# Altium project UZ_D_Temperature_Card_LTC2983.PrjPCB
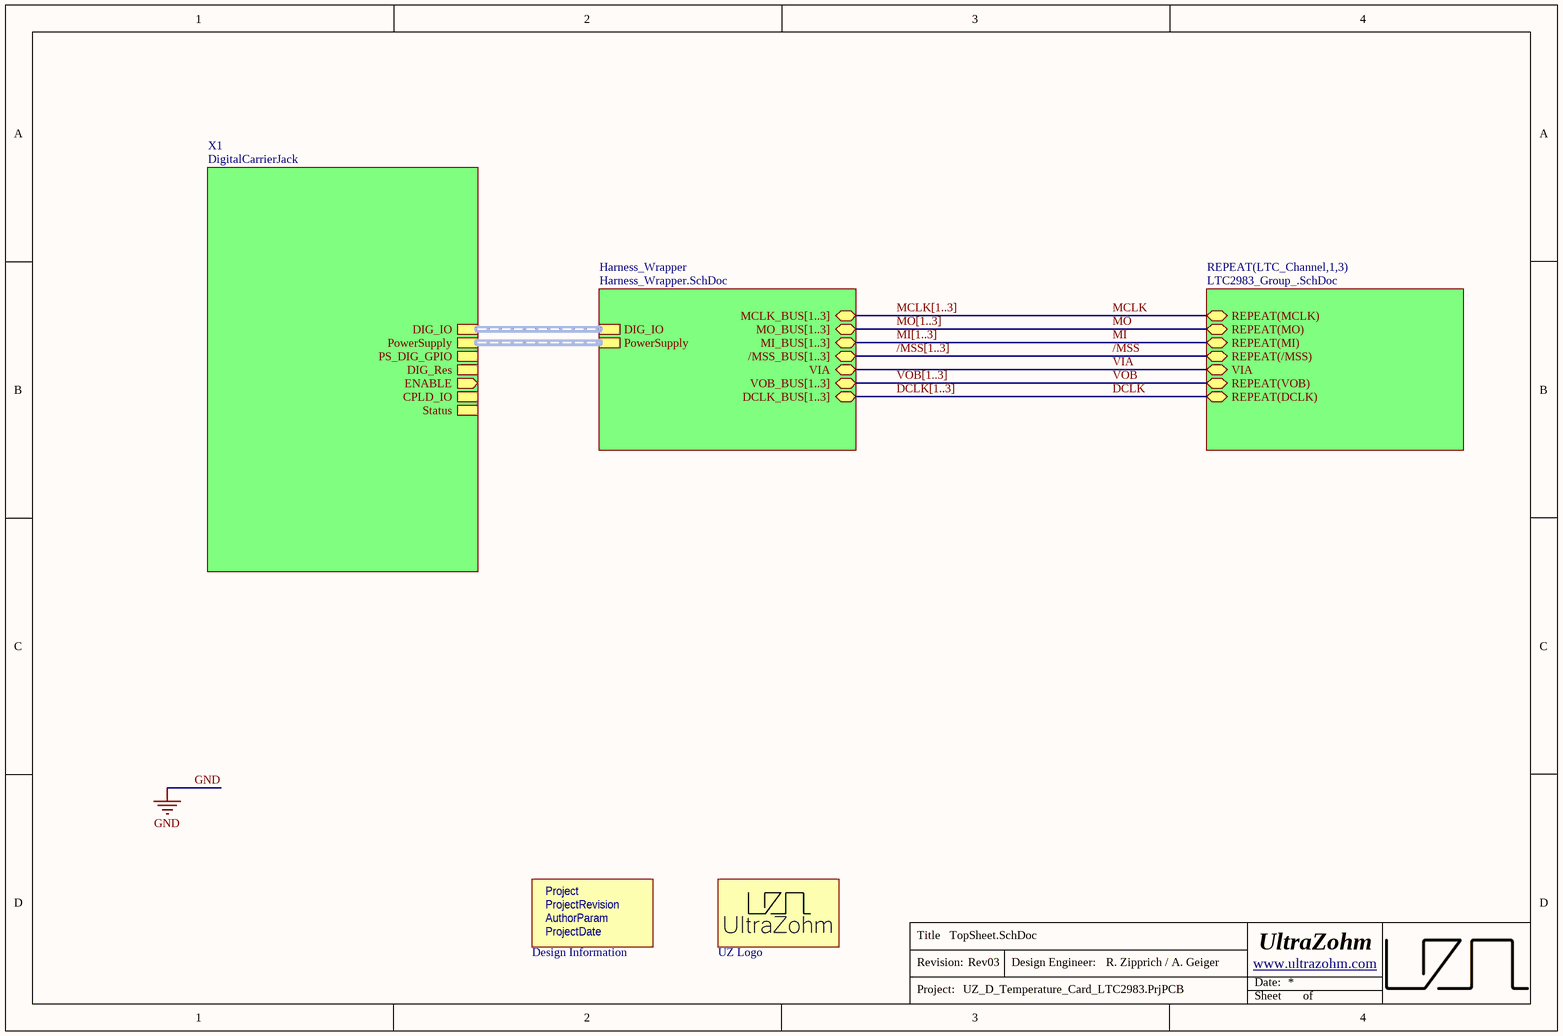
[diagram p0: TopSheet.SchDoc]
Author: R. Zipprich / A. Geiger; AuthorParam: R. Zipprich / A. Geiger; Project: UZ_D_Temperature_LTC2983; ProjectDate: 12/2023; ProjectRevision: Rev03
4 sheets, 296 parts. Net scope: hierarchical (ports join the sheet entries above them; power ports are global).
Board file: UZ_D_Temperature_Card_LTC2983.PcbDoc
Sheets:
  TopSheet.SchDoc
    X1 = DigitalCarrierJack.SchDoc
    LTC_Channel1 = LTC2983_Group_.SchDoc
    LTC_Channel2 = LTC2983_Group_.SchDoc
    LTC_Channel3 = LTC2983_Group_.SchDoc
    Harness_Wrapper = Harness_Wrapper.SchDoc

## Sheet TopSheet.SchDoc
size A4; Author: R. Zipprich / A. Geiger; CompanyName: Technische Hochschule Nürnberg Georg Simon Ohm; Organization: UltraZohm; Address1: Kesslerplatz 12; Address2: 90489 Nürnberg; Address3: GERMANY; Website: www.ultrazohm.com

### Parts
INFO  Design Information  [Design_info]  (no BOM)
LOGO  UZ Logo  [UZ_Logo_small]  (no BOM)

### Sub-sheets
Harness_Wrapper = Harness_Wrapper.SchDoc: DIG_IO (harness DigCon_DIG_IO), PowerSupply (harness DigCon_PowerSupply), VIA (bidir), MCLK_BUS[1..3] (bidir), MO_BUS[1..3] (bidir), MI_BUS[1..3] (bidir), /MSS_BUS[1..3] (bidir), VOB_BUS[1..3] (bidir), DCLK_BUS[1..3] (bidir)
REPEAT(LTC_Channel,1,3) = LTC2983_Group_.SchDoc: REPEAT(MCLK) (bidir), REPEAT(MO) (bidir), REPEAT(MI) (bidir), REPEAT(/MSS) (bidir), VIA (bidir), REPEAT(VOB) (bidir), REPEAT(DCLK) (bidir)
X1 = DigitalCarrierJack: DIG_IO (harness DigCon_DIG_IO), PowerSupply (harness DigCon_PowerSupply), PS_DIG_GPIO (harness DigCon_PS_DIG_GPIO), DIG_Res (harness DigCon_DIG_Res), ENABLE (out), CPLD_IO (harness DigCon_DCPLD_IO), Status (harness DigCon_Status)

### Nets
/MSS: sheet REPEAT(LTC_Channel,1,3)/REPEAT(/MSS)
DCLK: sheet REPEAT(LTC_Channel,1,3)/REPEAT(DCLK)
MCLK: sheet REPEAT(LTC_Channel,1,3)/REPEAT(MCLK)
MI: sheet REPEAT(LTC_Channel,1,3)/REPEAT(MI)
MO: sheet REPEAT(LTC_Channel,1,3)/REPEAT(MO)
VIA: sheet REPEAT(LTC_Channel,1,3)/VIA, sheet Harness_Wrapper/VIA
VOB: sheet REPEAT(LTC_Channel,1,3)/REPEAT(VOB)

### Buses and harness runs
bus /MSS[1..3] = sheet Harness_Wrapper//MSS_BUS[1..3]
bus DCLK[1..3] = sheet Harness_Wrapper/DCLK_BUS[1..3]
bus MCLK[1..3] = sheet Harness_Wrapper/MCLK_BUS[1..3]
bus MI[1..3] = sheet Harness_Wrapper/MI_BUS[1..3]
bus MO[1..3] = sheet Harness_Wrapper/MO_BUS[1..3]
bus VOB[1..3] = sheet Harness_Wrapper/VOB_BUS[1..3]
harness sheet Harness_Wrapper/DIG_IO = sheet X1/DIG_IO
harness sheet Harness_Wrapper/PowerSupply = sheet X1/PowerSupply

### Notes on the sheet
- Title
- Revision:
- Design Engineer:
- Date:
- Project:
- Sheet
- of
- (in symbol Design Information) Project; ProjectRevision; AuthorParam; ProjectDate

### Library data of the parts
INFO = Design Information: Manufacturer: UltraZohm; Created from: MGremer; Manufacturer Part Number: Design Information; PartID: 12; Created On: 03.11.2021 09:04:23; ComponentLink1Description: https://docs.ultrazohm.com/; ComponentLink1URL: homepage; Component Type: Design Information; Last Updated: 03.11.2021 09:28:34; Supplier 1: -; Supplier Part Number 1: -; Type: Design Information; Value: Design Information; Live Cycle Status: 1
LOGO = Logo small: Manufacturer: UltraZohm; Created from: MGremer; Created: Jan2021_Liegmann; Value: Logo; Manufacturer Part Number: Logo small; PartID: 10; Created On: 03.11.2021 09:04:23; ComponentLink1Description: https://docs.ultrazohm.com/; ComponentLink1URL: homepage; Component Type: Logo; Last Updated: 03.11.2021 09:05:50; Supplier 1: -; Supplier Part Number 1: -; Type: Logo; Live Cycle Status: 1

## Sheet DigitalCarrierJack.SchDoc
size A4; Author: R. Zipprich / A. Geiger; CompanyName: Technische Hochschule Nürnberg Georg Simon Ohm; Organization: UltraZohm; Address1: Kesslerplatz 12; Address2: 90489 Nürnberg; Address3: GERMANY; Website: www.ultrazohm.com
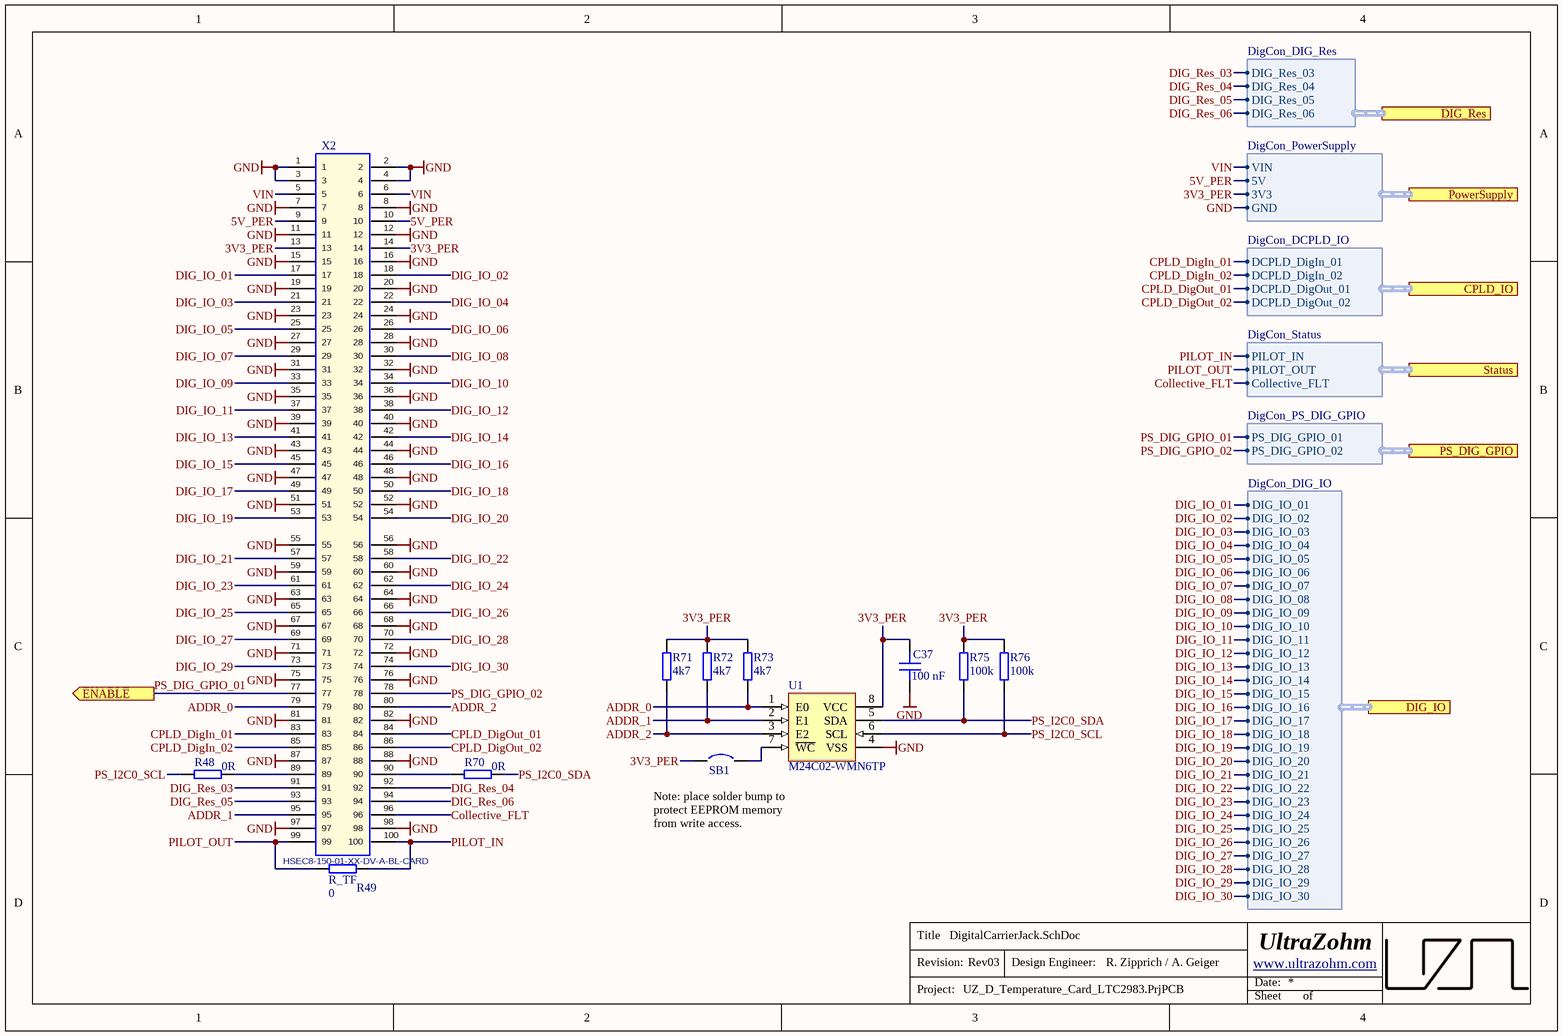
[diagram p1: DigitalCarrierJack.SchDoc]

### Parts
C37  100 nF  [C_0603]
R48  0R  [RES 0603_1608]
R49  R_TF  value 0  [RESC1608X55X30NL15T15]
R70  0R  [RES 0603_1608]
R71  4k7  [RES 0603_1608]
R72  4k7  [RES 0603_1608]
R73  4k7  [RES 0603_1608]
R75  100k  [RES 0603_1608]
R76  100k  [RES 0603_1608]
SB1  Solder Bump 0603  [SB_0603]  (value not drawn)  (no BOM)
U1  M24C02-WMN6TP  [D0008A_N]
X2  HSEC8-150-01-XX-DV-A-BL-CARD  [HSEC8-150-01-XX-DV-A-BL-CARD]  (no BOM)

### Ports
CPLD_IO (harness DigCon_DCPLD_IO), DIG_IO (harness DigCon_DIG_IO), DIG_Res (harness DigCon_DIG_Res), ENABLE (out), PowerSupply (harness DigCon_PowerSupply), PS_DIG_GPIO (harness DigCon_PS_DIG_GPIO), Status (harness DigCon_Status)

### Harnesses
DigCon_PowerSupply: GND, 3V3, 5V, VIN
DigCon_Status: PILOT_IN, PILOT_OUT, Collective_FLT
DigCon_DCPLD_IO: DCPLD_DigIn_01, DCPLD_DigIn_02, DCPLD_DigOut_01, DCPLD_DigOut_02
DigCon_PS_DIG_GPIO: PS_DIG_GPIO_01, PS_DIG_GPIO_02
DigCon_DIG_IO: DIG_IO_01, DIG_IO_02, DIG_IO_03, DIG_IO_04, DIG_IO_05, DIG_IO_06, DIG_IO_07, DIG_IO_08, DIG_IO_09, DIG_IO_10, DIG_IO_11, DIG_IO_12, DIG_IO_13, DIG_IO_14, DIG_IO_15, DIG_IO_16, DIG_IO_17, DIG_IO_18, DIG_IO_19, DIG_IO_20, DIG_IO_21, DIG_IO_22, DIG_IO_23, DIG_IO_24, DIG_IO_25, DIG_IO_26, DIG_IO_27, DIG_IO_28, DIG_IO_29, DIG_IO_30
DigCon_DIG_Res: DIG_Res_03, DIG_Res_04, DIG_Res_05, DIG_Res_06

### Nets
GND: C37.2 U1.4(VSS) X2.1 X2.2 X2.3 X2.4 X2.7 X2.8 X2.11 X2.12 X2.15 X2.16 X2.19 X2.20 X2.23 X2.24 X2.27 X2.28 X2.31 X2.32 X2.35 X2.36 X2.39 X2.40 X2.43 X2.44 X2.47 X2.48 X2.51 X2.52 X2.55 X2.56 X2.59 X2.60 X2.63 X2.64 X2.67 X2.68 X2.71 X2.72 X2.75 X2.76 X2.81 X2.82 X2.87 X2.88 X2.97 X2.98 ; port PowerSupply.GND
VIN: X2.5 X2.6 ; port PowerSupply.VIN
3V3_PER: C37.1 R71.2 R72.2 R73.2 R75.2 R76.2 SB1.1 U1.8(VCC) X2.13 X2.14 ; port PowerSupply.3V3
5V_PER: X2.9 X2.10 ; port PowerSupply.5V
ADDR_0: R73.1 U1.1(E0) X2.79
ADDR_1: R72.1 U1.2(E1) X2.95
ADDR_2: R71.1 U1.3(E2) X2.80
Collective_FLT: X2.96 ; port Status.Collective_FLT
CPLD_DigIn_01: X2.83 ; port CPLD_IO.DCPLD_DigIn_01
CPLD_DigIn_02: X2.85 ; port CPLD_IO.DCPLD_DigIn_02
CPLD_DigOut_01: X2.84 ; port CPLD_IO.DCPLD_DigOut_01
CPLD_DigOut_02: X2.86 ; port CPLD_IO.DCPLD_DigOut_02
DIG_IO_01: X2.17 ; port DIG_IO.DIG_IO_01
DIG_IO_02: X2.18 ; port DIG_IO.DIG_IO_02
DIG_IO_03: X2.21 ; port DIG_IO.DIG_IO_03
DIG_IO_04: X2.22 ; port DIG_IO.DIG_IO_04
DIG_IO_05: X2.25 ; port DIG_IO.DIG_IO_05
DIG_IO_06: X2.26 ; port DIG_IO.DIG_IO_06
DIG_IO_07: X2.29 ; port DIG_IO.DIG_IO_07
DIG_IO_08: X2.30 ; port DIG_IO.DIG_IO_08
DIG_IO_09: X2.33 ; port DIG_IO.DIG_IO_09
DIG_IO_10: X2.34 ; port DIG_IO.DIG_IO_10
DIG_IO_11: X2.37 ; port DIG_IO.DIG_IO_11
DIG_IO_12: X2.38 ; port DIG_IO.DIG_IO_12
DIG_IO_13: X2.41 ; port DIG_IO.DIG_IO_13
DIG_IO_14: X2.42 ; port DIG_IO.DIG_IO_14
DIG_IO_15: X2.45 ; port DIG_IO.DIG_IO_15
DIG_IO_16: X2.46 ; port DIG_IO.DIG_IO_16
DIG_IO_17: X2.49 ; port DIG_IO.DIG_IO_17
DIG_IO_18: X2.50 ; port DIG_IO.DIG_IO_18
DIG_IO_19: X2.53 ; port DIG_IO.DIG_IO_19
DIG_IO_20: X2.54 ; port DIG_IO.DIG_IO_20
DIG_IO_21: X2.57 ; port DIG_IO.DIG_IO_21
DIG_IO_22: X2.58 ; port DIG_IO.DIG_IO_22
DIG_IO_23: X2.61 ; port DIG_IO.DIG_IO_23
DIG_IO_24: X2.62 ; port DIG_IO.DIG_IO_24
DIG_IO_25: X2.65 ; port DIG_IO.DIG_IO_25
DIG_IO_26: X2.66 ; port DIG_IO.DIG_IO_26
DIG_IO_27: X2.69 ; port DIG_IO.DIG_IO_27
DIG_IO_28: X2.70 ; port DIG_IO.DIG_IO_28
DIG_IO_29: X2.73 ; port DIG_IO.DIG_IO_29
DIG_IO_30: X2.74 ; port DIG_IO.DIG_IO_30
DIG_Res_03: X2.91 ; port DIG_Res.DIG_Res_03
DIG_Res_04: X2.92 ; port DIG_Res.DIG_Res_04
DIG_Res_05: X2.93 ; port DIG_Res.DIG_Res_05
DIG_Res_06: X2.94 ; port DIG_Res.DIG_Res_06
PILOT_IN: R49.2 X2.100 ; port Status.PILOT_IN
PILOT_OUT: R49.1 X2.99 ; port Status.PILOT_OUT
PS_DIG_GPIO_01: X2.77 ; port ENABLE, port PS_DIG_GPIO.PS_DIG_GPIO_01
PS_DIG_GPIO_02: X2.78 ; port PS_DIG_GPIO.PS_DIG_GPIO_02
PS_I2C0_SCL: R48.1 R76.1 U1.6(SCL)
PS_I2C0_SDA: R70.2 R75.1 U1.5(SDA)
NetR48_2: R48.2 X2.89
NetR70_1: R70.1 X2.90
NetSB1_2: SB1.2 U1.7(~{WC})

### Notes on the sheet
- Note: place solder bump to protect EEPROM memory from write access.
- Title
- Revision:
- Design Engineer:
- Date:
- Project:
- Sheet
- of

### Library data of the parts
C37 = C0603C104K9PACTU: Capacitor 0603, 6.3 VDC, 100 nF, X5R; Manufacturer: KEMET; Tolerance: 10 %; Voltage Rating: 6.3 VDC; Created from: MGremer; Manufacturer Part Number: C0603C104K9PACTU; PartID: 70; Created On: 20.12.2020 13:54:13; ComponentLink1Description: Datasheet; ComponentLink1URL: https://www.mouser.de/datasheet/2/212/KEM_C1006_X5R_SMD-1103249.pdf; Component Type: Capacitor 0603; Device Package: 0603; Last Updated: 25.01.2024 18:56:23; Mounting Type: SMD; Operating Temperature: -55 - 85°C; Series: SMD Comm X5R; Supplier 1: Mouser; Supplier Part Number 1: 80-C0603C104K9P; Type: Capacitor; Value: 100 nF; Live Cycle Status: 1; Stock number: not stored; LCSC Part Number: C14663
R48 R70 = RC0603JR-070RL: SMD resistor E24 series; Manufacturer: YAGEO; Tolerance: 5%; Created from: MGremer; Manufacturer Part Number: RC0603JR-070RL; PartID: 1; Created On: 14.12.2020 16:17:14; ComponentLink1Description: Datasheet; ComponentLink1URL: https://www.mouser.de/datasheet/2/447/PYu-RC_Group_51_RoHS_L_10-1664068.pdf; Component Type: SMD resistor; Device Package: 0603; Last Updated: 04.03.2021 09:09:42; Mounting Type: SMD; Supplier 1: Mouser; Supplier Part Number 1: 603-RC0603JR-070RL; Supplier 2: LCSC; Supplier Part Number 2: C21189; Type: Resistor; Value: 0R; Live Cycle Status: 1; Stock number: Labor SMD Container; LCSC Part Number: C21189
R49 = R_0.1W_SMD: Standard thick film resistor; MPN: ERJU030R00V; Parameter1: V; Parameter1Desc: Package Method; Parameter2: F; Parameter2Desc: Tolerance Symbol; MaxVoltage: 100; MF: Panasonic; Created: 2019-12-08_Thilo_Wendt; Supplier 1: Mouser; Package: RESC1608X55X30NL15T15; HelpURL: https://www.mouser.de/datasheet/2/315/AOA0000C334-1314047.pdf; Parameter3: *; Parameter3Desc: *; ComponentLink1Description: Datasheet; ComponentLink1URL: https://www.mouser.de/datasheet/2/315/AOA0000C334-1314047.pdf; Supplier Part Number 1: 667-ERJ-U030R00V; LCSC Part Number: C21189
R71-R73 = 0603WAF4701T5E: SMD resistor E24 series; Manufacturer: UNI-ROYAL; Tolerance: 1%; Created from: AGeiger; Manufacturer Part Number: 0603WAF4701T5E; PartID: 90; Created On: 14.12.2020 16:17:14; ComponentLink1Description: Datasheet; ComponentLink1URL: https://datasheet.lcsc.com/lcsc/2206010116_UNI-ROYAL-Uniroyal-Elec-0603WAF4701T5E_C23162.pdf; Component Type: SMD resistor; Device Package: 0603; Last Updated: 25.08.2022 20:03:04; Mounting Type: SMD; Supplier 1: LCSC; Supplier Part Number 1: C23162; Type: Resistor; Value: 4k7; Live Cycle Status: 1; Stock number: Labor SMD Container; LCSC Part Number: C23162
R75 R76 = RK73B1JTTD104J: SMD resistor E24 series; Manufacturer: KOA Speer; Tolerance: 5%; Created from: MGremer; Manufacturer Part Number: RK73B1JTTD104J; PartID: 122; Created On: 14.12.2020 16:17:14; ComponentLink1Description: Datasheet; ComponentLink1URL: https://www.mouser.de/datasheet/2/219/RK73B-1825463.pdf; Component Type: SMD resistor; Device Package: 0603; Last Updated: 27.05.2022 14:04:10; Mounting Type: SMD; Supplier 1: Mouser; Supplier Part Number 1: 660-RK73B1JTTD104J; Type: Resistor; Value: 100k; Live Cycle Status: 1; Stock number: Labor SMD Container; LCSC Part Number: C25803
SB1 = =Value: Created from: AGeiger; Revision: July-2002: Re-released for DXP Platform.; PartID: 1; Created On: 09.01.2024 17:13:56; Component Type: Solder Bump; Device Package: 0603; Last Updated: 09.01.2024 17:13:56; Manufacturer Part Number: Solder Bump 0603; Mounting Type: SMD; Value: Solder Bump 0603
U1 = M24C02-WMN6TP: 2Kbit I2C SOP-8 EEPROM ROHS; Manufacturer: STMicroelectronics; Created from: AGeiger; Manufacturer Part Number: M24C02-WMN6TP; PartID: 1; Created On: 19.11.2023 14:54:27; ComponentLink1Description: Datasheet; ComponentLink1URL: https://www.st.com/resource/en/datasheet/m24c01-w.pdf; Component Type: EEPROM; Device Package: SOIC-8; Last Updated: 19.11.2023 21:39:04; Mounting Type: SMD; Operating Temperature: -40 to +85 °C; Series: M24xxx; Supplier 1: Mouser; Supplier Part Number 1: 511-M24C02-WMN6TP; Supplier 2: LCSC; Supplier Part Number 2: C7562; Type: Memory; Value: M24C02-WMN6TP; LCSC Part Number: C7562
X2 = HSEC8-150-01-XX-DV-A-BL-CARD: Mating Card Layout for HSEC8-150-01-XX-DV-A-BL; Manufacturer: SAMTEC; Created: 2018_04_23_AGeiger; Value: HSEC8-150-01-XX-DV-A-BL-CARD

## Sheet LTC2983_Group_.SchDoc
size A4; Author: R. Zipprich / A. Geiger; CompanyName: Technische Hochschule Nürnberg Georg Simon Ohm; Organization: UltraZohm; Address1: Kesslerplatz 12; Address2: 90489 Nürnberg; Address3: GERMANY; Website: www.ultrazohm.com
Used 3 times, as channels LTC_Channel1, LTC_Channel2, LTC_Channel3. Parts and nets are listed once, with the designators drawn on the sheet.
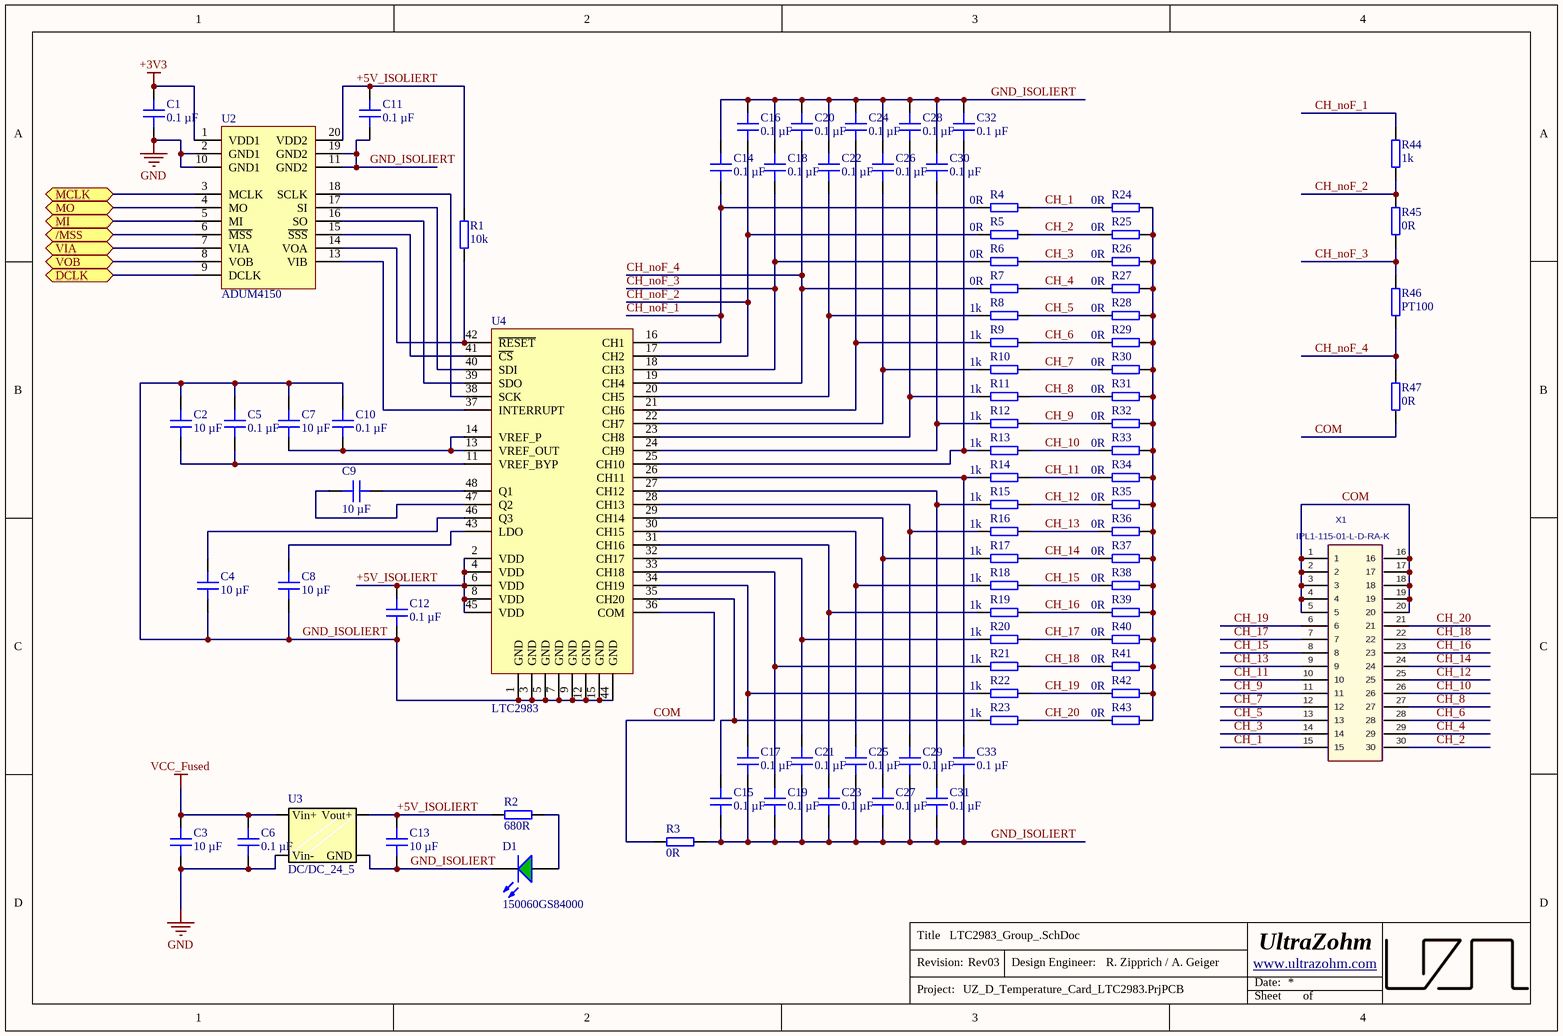
[diagram p2: LTC2983_Group_.SchDoc]

### Parts
C1  0.1 µF  [C_0603]
C2  10 µF  [C_0603]
C3  10 µF  [C_0603]
C4  10 µF  [C_0603]
C5  0.1 µF  [C_0603]
C6  0.1 µF  [C_0603]
C7  10 µF  [C_0603]
C8  10 µF  [C_0603]
C9  10 µF  [C_0603]
C10  0.1 µF  [C_0603]
C11  0.1 µF  [C_0603]
C12  0.1 µF  [C_0603]
C13  10 µF  [C_0603]
C14  0.1 µF  [C_0603]
C15  0.1 µF  [C_0603]
C16  0.1 µF  [C_0603]
C17  0.1 µF  [C_0603]
C18  0.1 µF  [C_0603]
C19  0.1 µF  [C_0603]
C20  0.1 µF  [C_0603]
C21  0.1 µF  [C_0603]
C22  0.1 µF  [C_0603]
C23  0.1 µF  [C_0603]
C24  0.1 µF  [C_0603]
C25  0.1 µF  [C_0603]
C26  0.1 µF  [C_0603]
C27  0.1 µF  [C_0603]
C28  0.1 µF  [C_0603]
C29  0.1 µF  [C_0603]
C30  0.1 µF  [C_0603]
C31  0.1 µF  [C_0603]
C32  0.1 µF  [C_0603]
C33  0.1 µF  [C_0603]
D1  150060GS84000  [WL-SMCW_0603]
R1  10k  [RES 0603_1608]
R2  680R  [RES 0603_1608]
R3  0R  [RES 0603_1608]
R4  0R  [RES 0603_1608]
R5  0R  [RES 0603_1608]
R6  0R  [RES 0603_1608]
R7  0R  [RES 0603_1608]
R8  1k  [RES 0603_1608]
R9  1k  [RES 0603_1608]
R10  1k  [RES 0603_1608]
R11  1k  [RES 0603_1608]
R12  1k  [RES 0603_1608]
R13  1k  [RES 0603_1608]
R14  1k  [RES 0603_1608]
R15  1k  [RES 0603_1608]
R16  1k  [RES 0603_1608]
R17  1k  [RES 0603_1608]
R18  1k  [RES 0603_1608]
R19  1k  [RES 0603_1608]
R20  1k  [RES 0603_1608]
R21  1k  [RES 0603_1608]
R22  1k  [RES 0603_1608]
R23  1k  [RES 0603_1608]
R24  0R  [RES 0603_1608]
R25  0R  [RES 0603_1608]
R26  0R  [RES 0603_1608]
R27  0R  [RES 0603_1608]
R28  0R  [RES 0603_1608]
R29  0R  [RES 0603_1608]
R30  0R  [RES 0603_1608]
R31  0R  [RES 0603_1608]
R32  0R  [RES 0603_1608]
R33  0R  [RES 0603_1608]
R34  0R  [RES 0603_1608]
R35  0R  [RES 0603_1608]
R36  0R  [RES 0603_1608]
R37  0R  [RES 0603_1608]
R38  0R  [RES 0603_1608]
R39  0R  [RES 0603_1608]
R40  0R  [RES 0603_1608]
R41  0R  [RES 0603_1608]
R42  0R  [RES 0603_1608]
R43  0R  [RES 0603_1608]
R44  1k  [RES 0603_1608]
R45  0R  [RES 0603_1608]
R46  PT100  [RES 0603_1608]
R47  0R  [RES 0603_1608]
U2  ADUM4150  [SOIC-20-ADUM4150]
U3  DC/DC_24_5  [SIP4DCDC]
U4  LTC2983  [48_LGFP(7x7)]
X1  IPL1-115-01-L-D-RA-K  [IPL1-115-01-XX-D-RA]

### Ports
/MSS (bidir), DCLK (bidir), MCLK (bidir), MI (bidir), MO (bidir), VIA (bidir), VOB (bidir)

### Nets
+3V3: C1.2 U2.1(VDD1)
GND: C1.1 C3.1 C6.1 U2.2(GND1) U2.10(GND1) U3.2(Vin-)
VCC_Fused: C3.2 C6.2 U3.1(Vin+)
+5V_ISOLIERT: C11.2 C12.2 C13.2 R1.2 R2.1 U2.20(VDD2) U3.6(Vout+) U4.2(VDD) U4.4(VDD) U4.6(VDD) U4.8(VDD) U4.45(VDD)
/MSS: U2.6(~{MSS}) ; port /MSS
CH_1: R4.2 R24.1 X1.15
CH_2: R5.2 R25.1 X1.30
CH_3: R6.2 R26.1 X1.14
CH_4: R7.2 R27.1 X1.29
CH_5: R8.2 R28.1 X1.13
CH_6: R9.2 R29.1 X1.28
CH_7: R10.2 R30.1 X1.12
CH_8: R11.2 R31.1 X1.27
CH_9: R12.2 R32.1 X1.11
CH_10: R13.2 R33.1 X1.26
CH_11: R14.2 R34.1 X1.10
CH_12: R15.2 R35.1 X1.25
CH_13: R16.2 R36.1 X1.9
CH_14: R17.2 R37.1 X1.24
CH_15: R18.2 R38.1 X1.8
CH_16: R19.2 R39.1 X1.23
CH_17: R20.2 R40.1 X1.7
CH_18: R21.2 R41.1 X1.22
CH_19: R22.2 R42.1 X1.6
CH_20: R23.2 R43.1 X1.21
CH_noF_1: C14.1 R4.1 R44.2 U4.16(CH1)
CH_noF_2: C16.1 R5.1 R44.1 R45.2 U4.17(CH2)
CH_noF_3: C18.1 R6.1 R45.1 R46.2 U4.18(CH3)
CH_noF_4: C20.1 R7.1 R46.1 R47.2 U4.19(CH4)
COM: R3.1 R47.1 U4.36(COM) X1.1 X1.2 X1.3 X1.4 X1.5 X1.16 X1.17 X1.18 X1.19 X1.20
DCLK: U2.9(DCLK) ; port DCLK
GND_ISOLIERT: C2.2 C4.1 C5.2 C7.2 C8.1 C10.2 C11.1 C12.1 C13.1 C14.2 C15.1 C16.2 C17.1 C18.2 C19.1 C20.2 C21.1 C22.2 C23.1 C24.2 C25.1 C26.2 C27.1 C28.2 C29.1 C30.2 C31.1 C32.2 C33.1 D1.1(K) R3.2 U2.11(GND2) U2.19(GND2) U3.4(GND) U4.1(GND) U4.3(GND) U4.5(GND) U4.7(GND) U4.9(GND) U4.12(GND) U4.15(GND) U4.44(GND)
MCLK: U2.3(MCLK) ; port MCLK
MI: U2.5(MI) ; port MI
MO: U2.4(MO) ; port MO
VIA: U2.7(VIA) ; port VIA
VOB: U2.8(VOB) ; port VOB
NetC2_1: C2.1 C5.1 U4.11(VREF_BYP)
NetC4_2: C4.2 U4.46(Q3)
NetC7_1: C7.1 C10.1 U4.13(VREF_OUT) U4.14(VREF_P)
NetC8_2: C8.2 U4.43(LDO)
NetC9_1: C9.1 U4.48(Q1)
NetC9_2: C9.2 U4.47(Q2)
NetC15_2: C15.2 R23.1 U4.35(CH20)
NetC17_2: C17.2 R22.1 U4.34(CH19)
NetC19_2: C19.2 R21.1 U4.33(CH18)
NetC21_2: C21.2 R20.1 U4.32(CH17)
NetC22_1: C22.1 R8.1 U4.20(CH5)
NetC23_2: C23.2 R19.1 U4.31(CH16)
NetC24_1: C24.1 R9.1 U4.21(CH6)
NetC25_2: C25.2 R18.1 U4.30(CH15)
NetC26_1: C26.1 R10.1 U4.22(CH7)
NetC27_2: C27.2 R17.1 U4.29(CH14)
NetC28_1: C28.1 R11.1 U4.23(CH8)
NetC29_2: C29.2 R16.1 U4.28(CH13)
NetC30_1: C30.1 R12.1 U4.24(CH9)
NetC31_2: C31.2 R15.1 U4.27(CH12)
NetC32_1: C32.1 R13.1 U4.25(CH10)
NetC33_2: C33.2 R14.1 U4.26(CH11)
NetD1_2: D1.2(A) R2.2
NetR1_1: R1.1 U2.14(VOA) U4.42(~{RESET})
NetR24_2: R24.2 R25.2 R26.2 R27.2 R28.2 R29.2 R30.2 R31.2 R32.2 R33.2 R34.2 R35.2 R36.2 R37.2 R38.2 R39.2 R40.2 R41.2 R42.2 R43.2
NetU2_13: U2.13(VIB) U4.37(INTERRUPT)
NetU2_15: U2.15(~{SSS}) U4.41(~{CS})
NetU2_16: U2.16(SO) U4.39(SDO)
NetU2_17: U2.17(SI) U4.40(SDI)
NetU2_18: U2.18(SCLK) U4.38(SCK)

### Channels
LTC_Channel1: designators C1=C1A C2=C2A C3=C3A C4=C4A C5=C5A C6=C6A C7=C7A C8=C8A C9=C9A C10=C10A C11=C11A C12=C12A C13=C13A C14=C14A C15=C15A C16=C16A C17=C17A C18=C18A C19=C19A C20=C20A C21=C21A C22=C22A C23=C23A C24=C24A C25=C25A C26=C26A C27=C27A C28=C28A C29=C29A C30=C30A C31=C31A C32=C32A C33=C33A D1=D1A R1=R1A R2=R2A R3=R3A R4=R4A R5=R5A R6=R6A R7=R7A R8=R8A R9=R9A R10=R10A R11=R11A R12=R12A R13=R13A R14=R14A R15=R15A R16=R16A R17=R17A R18=R18A R19=R19A R20=R20A R21=R21A R22=R22A R23=R23A R24=R24A R25=R25A R26=R26A R27=R27A R28=R28A R29=R29A R30=R30A R31=R31A R32=R32A R33=R33A R34=R34A R35=R35A R36=R36A R37=R37A R38=R38A R39=R39A R40=R40A R41=R41A R42=R42A R43=R43A R44=R44A R45=R45A R46=R46A R47=R47A U2=IC1A U3=IC2A U4=IC3A X1=X1A; ports /MSS=/MSS1 DCLK=DCLK1 MCLK=MCLK1 MI=MI1 MO=MO1 VIA=VIA VOB=VOB1
LTC_Channel2: designators C1=C1B C2=C2B C3=C3B C4=C4B C5=C5B C6=C6B C7=C7B C8=C8B C9=C9B C10=C10B C11=C11B C12=C12B C13=C13B C14=C14B C15=C15B C16=C16B C17=C17B C18=C18B C19=C19B C20=C20B C21=C21B C22=C22B C23=C23B C24=C24B C25=C25B C26=C26B C27=C27B C28=C28B C29=C29B C30=C30B C31=C31B C32=C32B C33=C33B D1=D1B R1=R1B R2=R2B R3=R3B R4=R4B R5=R5B R6=R6B R7=R7B R8=R8B R9=R9B R10=R10B R11=R11B R12=R12B R13=R13B R14=R14B R15=R15B R16=R16B R17=R17B R18=R18B R19=R19B R20=R20B R21=R21B R22=R22B R23=R23B R24=R24B R25=R25B R26=R26B R27=R27B R28=R28B R29=R29B R30=R30B R31=R31B R32=R32B R33=R33B R34=R34B R35=R35B R36=R36B R37=R37B R38=R38B R39=R39B R40=R40B R41=R41B R42=R42B R43=R43B R44=R44B R45=R45B R46=R46B R47=R47B U2=IC1B U3=IC2B U4=IC3B X1=X1B; ports /MSS=/MSS2 DCLK=DCLK2 MCLK=MCLK2 MI=MI2 MO=MO2 VIA=VIA VOB=VOB2
LTC_Channel3: designators C1=C1C C2=C2C C3=C3C C4=C4C C5=C5C C6=C6C C7=C7C C8=C8C C9=C9C C10=C10C C11=C11C C12=C12C C13=C13C C14=C14C C15=C15C C16=C16C C17=C17C C18=C18C C19=C19C C20=C20C C21=C21C C22=C22C C23=C23C C24=C24C C25=C25C C26=C26C C27=C27C C28=C28C C29=C29C C30=C30C C31=C31C C32=C32C C33=C33C D1=D1C R1=R1C R2=R2C R3=R3C R4=R4C R5=R5C R6=R6C R7=R7C R8=R8C R9=R9C R10=R10C R11=R11C R12=R12C R13=R13C R14=R14C R15=R15C R16=R16C R17=R17C R18=R18C R19=R19C R20=R20C R21=R21C R22=R22C R23=R23C R24=R24C R25=R25C R26=R26C R27=R27C R28=R28C R29=R29C R30=R30C R31=R31C R32=R32C R33=R33C R34=R34C R35=R35C R36=R36C R37=R37C R38=R38C R39=R39C R40=R40C R41=R41C R42=R42C R43=R43C R44=R44C R45=R45C R46=R46C R47=R47C U2=IC1C U3=IC2C U4=IC3C X1=X1C; ports /MSS=/MSS3 DCLK=DCLK3 MCLK=MCLK3 MI=MI3 MO=MO3 VIA=VIA VOB=VOB3

### Notes on the sheet
- Title
- Revision:
- Design Engineer:
- Date:
- Project:
- Sheet
- of

### Library data of the parts
C1 C5 C6 C10-C12 C14-C33 = C0603X104K5RAC7411: Capacitor 0603, 50 VDC, 0.1 µF, X7R; Manufacturer: KEMET; Tolerance: 10 %; Voltage Rating: 50 VDC; Created from: MGremer; Manufacturer Part Number: C0603X104K5RAC7411; PartID: 3; Created On: 20.12.2020 13:54:13; ComponentLink1Description: Datasheet; ComponentLink1URL: https://www.mouser.de/datasheet/2/212/1/KEM_C1013_X7R_FT_CAP_SMD-1103280.pdf; Component Type: Capacitor 0603; Device Package: 0603; Last Updated: 04.03.2021 09:24:28; Mounting Type: SMD; Operating Temperature: -55 - 125°C; Series: SMD Comm X7R Flex; Supplier 1: Mouser; Supplier Part Number 1: 80-C0603X104K5R7411; Type: Capacitor; Value: 0.1 µF; Live Cycle Status: 1; Stock number: Labor SMD Container; Supplier 2: LCSC; Supplier Part Number 2: C14663; LCSC Part Number: C14663
C2-C4 C7-C9 C13 = GRM185R60J106ME15D: Capacitor 0603, 6.3 VDC, 10 µF, X5R; Manufacturer: muRata; Tolerance: 20 %; Voltage Rating: 6.3 VDC; Created from: MGremer; Manufacturer Part Number: GRM185R60J106ME15D; PartID: 10; Created On: 20.12.2020 13:54:13; ComponentLink1Description: Datasheet; ComponentLink1URL: https://www.mouser.de/datasheet/2/281/murata_03052018_GRM_Series_1-1310166.pdf; Component Type: Capacitor 0603; Device Package: 0603; Last Updated: 27.05.2022 14:13:40; Mounting Type: SMD; Operating Temperature: -55 - 85°C; Series: GRM; Supplier 1: Mouser; Supplier Part Number 1: 81-GRM185R60J106ME5D; Type: Capacitor; Value: 10 µF; Live Cycle Status: 1; Stock number: Labor SMD Container; LCSC Part Number: C19702
D1 = 150060GS84000: WL-SMCW SMD Mono-color Chip LED Waterclear Green; Manufacturer: Wuerth Elektronik; Type: Standard; Created from: MGremer; Forward Current I_f: 20 mA; Forward Voltage U_f: 3.2 V; Wavelength: 525 nm; Light Intensity: 3000 mcd; Nominal Power: 78 mW; Manufacturer Part Number: 150060GS84000; PartID: 2; Created On: 08.12.2020 10:41:11; ComponentLink1Description: Datasheet; ComponentLink1URL: https://www.mouser.de/datasheet/2/445/150060GS75020-1714345.pdf; Component Type: LED Diode; Device Package: 0603; Last Updated: 25.01.2024 19:29:32; Mounting Type: SMD; Operating Temperature: -40 - 85 °C; Supplier 1: Mouser; Supplier Part Number 1: 710-150060GS84000; Supplier 2: Farnell; Supplier Part Number 2: 3408612; Supplier 3: Digi-Key; Supplier Part Number 3: 732-150060GS84000CT-ND; Live Cycle Status: 1; Stock number: not stored; Color: green; LCSC Part Number: C72043
R1 = RK73B1JTTD103J: SMD resistor E24 series; Manufacturer: KOA Speer; Tolerance: 5%; Created from: MGremer; Manufacturer Part Number: RK73B1JTTD103J; PartID: 98; Created On: 14.12.2020 16:17:14; ComponentLink1Description: Datasheet; ComponentLink1URL: https://www.mouser.de/datasheet/2/219/RK73B-1825463.pdf; Component Type: SMD resistor; Device Package: 0603; Last Updated: 27.05.2022 14:04:22; Mounting Type: SMD; Supplier 1: Mouser; Supplier Part Number 1: 660-RK73B1JTTD103J; Type: Resistor; Value: 10k; Live Cycle Status: 1; Stock number: Labor SMD Container; LCSC Part Number: C25804
R2 = RK73B1JTTDD681J: SMD resistor E24 series; Manufacturer: KOA Speer; Tolerance: 5%; Created from: MGremer; Manufacturer Part Number: RK73B1JTTDD681J; PartID: 70; Created On: 14.12.2020 16:17:14; ComponentLink1Description: Datasheet; ComponentLink1URL: https://www.mouser.de/datasheet/2/219/RK73B-1825463.pdf; Component Type: SMD resistor; Device Package: 0603; Last Updated: 27.05.2022 08:00:04; Mounting Type: SMD; Supplier 1: Mouser; Supplier Part Number 1: 660-RK73B1JTTDD681J; Type: Resistor; Value: 680R; Live Cycle Status: 1; Stock number: Labor SMD Container; Supplier 2: LCSC; Supplier Part Number 2: C23228; LCSC Part Number: C23228
R3-R7 R24-R43 R45 R47 = RC0603JR-070RL: as R48 on sheet DigitalCarrierJack; Manufacturer Part Number: RC0603JR-070RL; PartID: 1; Created On: 14.12.2020 16:17:14; ComponentLink1Description: Datasheet; ComponentLink1URL: https://www.mouser.de/datasheet/2/447/PYu-RC_Group_51_RoHS_L_10-1664068.pdf; Component Type: SMD resistor; Device Package: 0603; Last Updated: 04.03.2021 09:09:42; Mounting Type: SMD; Supplier 1: Mouser; Supplier Part Number 1: 603-RC0603JR-070RL; Supplier 2: LCSC; Supplier Part Number 2: C21189; Type: Resistor; Value: 0R; Live Cycle Status: 1; Stock number: Labor SMD Container; LCSC Part Number: C21189
R8-R23 = 0603WAF1001T5E: SMD resistor E24 series; Manufacturer: UNI-ROYAL; Tolerance: 1%; Created from: AGeiger; Manufacturer Part Number: 0603WAF1001T5E; PartID: 74; Created On: 14.12.2020 16:17:14; ComponentLink1Description: Datasheet; ComponentLink1URL: https://datasheet.lcsc.com/lcsc/2206010130_UNI-ROYAL-Uniroyal-Elec-0603WAF1001T5E_C21190.pdf; Component Type: SMD resistor; Device Package: 0603; Last Updated: 25.08.2022 16:01:46; Mounting Type: SMD; Supplier 1: LCSC; Supplier Part Number 1: C21190; Type: Resistor; Value: 1k; Live Cycle Status: 1; Stock number: Labor SMD Container; LCSC Part Number: C21190
R44 = PCF-W0603LF-03-1001-B-P-LT: SMD resistor 0.1%; Manufacturer: IRC / TT Electronics; Created from: MGremer; Manufacturer Part Number: PCF-W0603LF-03-1001-B-P-LT; PartID: 163; Created On: 14.12.2020 16:17:14; ComponentLink1Description: Datasheet; ComponentLink1URL: https://www.mouser.de/datasheet/2/414/PCF-1528243.pdf; Component Type: SMD resistor; Device Package: 0603; Last Updated: 02.03.2021 14:07:32; Mounting Type: SMD; Supplier 1: Mouser; Supplier Part Number 1: 66-PCFW0603LF031001B; Type: Resistor; Tolerance: 0.1%; Value: 1k; Live Cycle Status: 1; Stock number: not stored
R46 = PCF-W0603LF-03-1001-B-P-LT: SMD resistor 0.1%; Manufacturer: IRC / TT Electronics; Value: 1k; Created from: MGremer; Manufacturer Part Number: PCF-W0603LF-03-1001-B-P-LT; PartID: 163; Created On: 14.12.2020 16:17:14; ComponentLink1Description: Datasheet; ComponentLink1URL: https://www.mouser.de/datasheet/2/414/PCF-1528243.pdf; Component Type: SMD resistor; Device Package: 0603; Last Updated: 02.03.2021 14:07:32; Mounting Type: SMD; Supplier 1: Mouser; Supplier Part Number 1: 66-PCFW0603LF031001B; Type: Resistor; Tolerance: 0.1%; Live Cycle Status: 1; Stock number: not stored
U3 = DC/DC_Single: pin to pad: 1>2 2>1 4>3 6>4; LCSC Part Number: C970824
X1 = IPL1-115-01-L-D-RA-K: Terminal Assembly, Double Row, Right Angle, Thru-Hole, 2.54 mm x 2.54 mm Pitch, 30 Pins; Manufacturer: SAMTEC; Created from: TWendt; Number of positions: 30; Manufacturer Part Number: IPL1-115-01-L-D-RA-K; PartID: 34; Created On: 12.02.2021 15:31:18; ComponentLink1Description: Homepage; ComponentLink1URL: https://www.samtec.com/products/ipl1; Component Type: Samtec Connector; Device Package: Connector; Last Updated: 15.02.2021 10:07:42; Supplier 1: SAMTEC; Supplier Part Number 1: IPL1-115-01-L-D-RA-K; Type: Connector; Live Cycle Status: 1; Number of rows: 2; Stock number: not stored; LCSC Part Number: C7423882
U2 = ADUM4150: LCSC Part Number: C660948
U4 = LTC2983: LCSC Part Number: C427448

## Sheet Harness_Wrapper.SchDoc
size A4; Author: R. Zipprich / A. Geiger; CompanyName: Technische Hochschule Nürnberg Georg Simon Ohm; Organization: UltraZohm; Address1: Kesslerplatz 12; Address2: 90489 Nürnberg; Address3: GERMANY; Website: www.ultrazohm.com
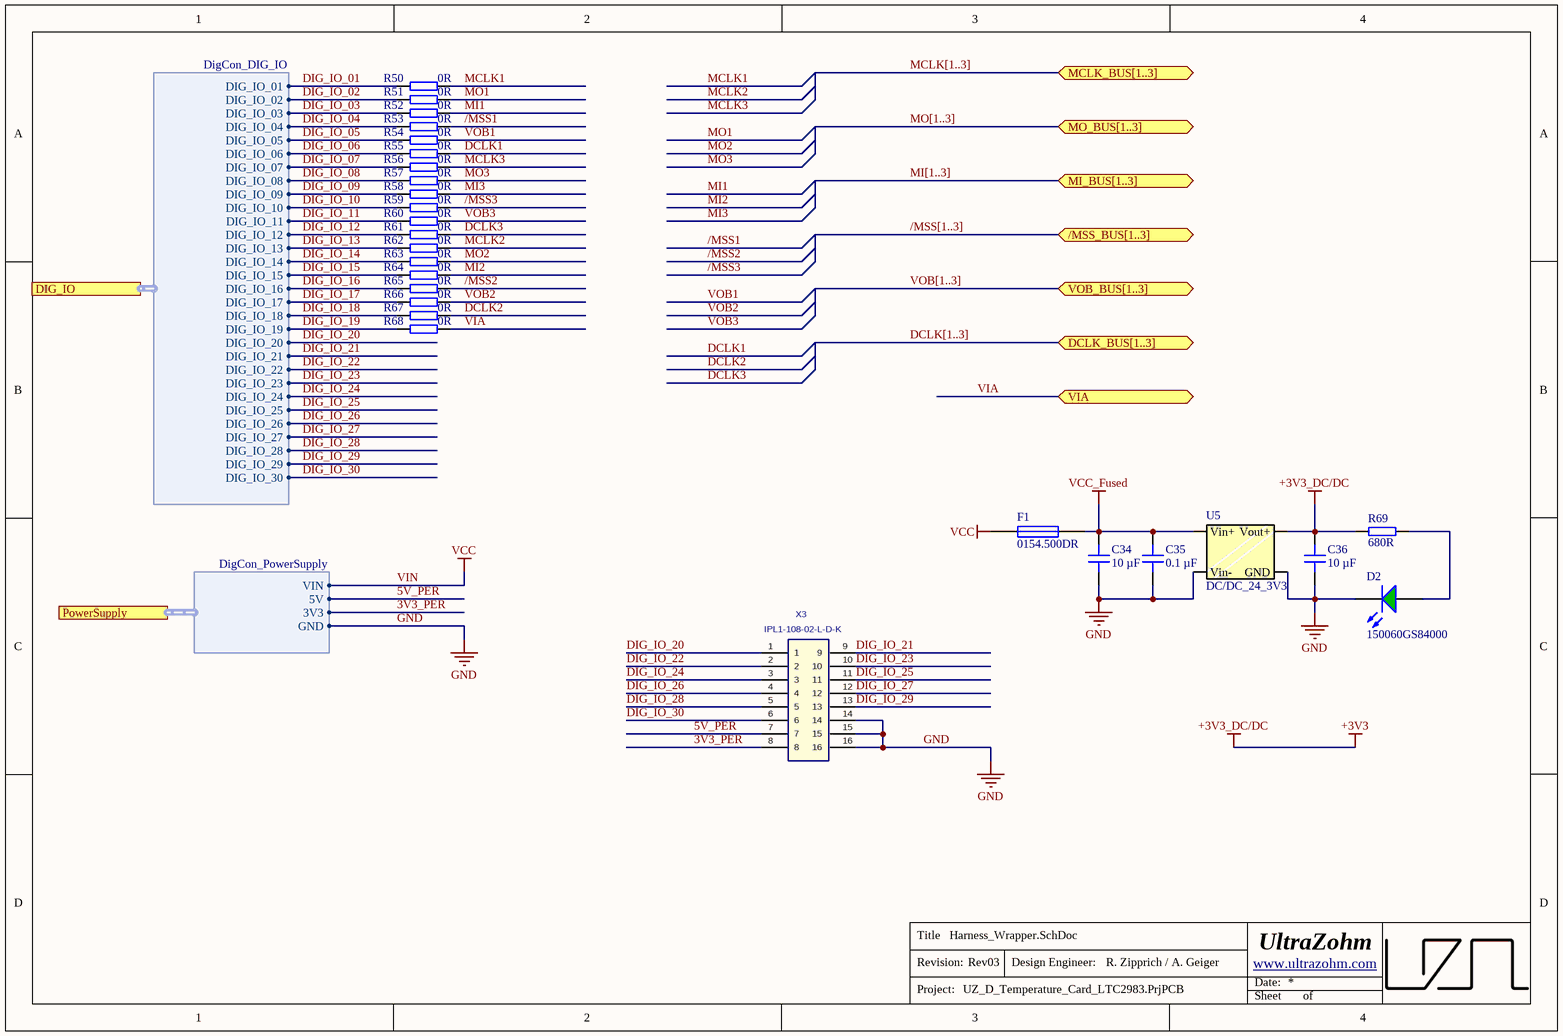
[diagram p3: Harness_Wrapper.SchDoc]

### Parts
C34  10 µF  [C_0603]
C35  0.1 µF  [C_0603]
C36  10 µF  [C_0603]
D2  150060GS84000  [WL-SMCW_0603]
F1  0154.500DR  [Littlefuse_154]
R50  0R  [RES 0603_1608]
R51  0R  [RES 0603_1608]
R52  0R  [RES 0603_1608]
R53  0R  [RES 0603_1608]
R54  0R  [RES 0603_1608]
R55  0R  [RES 0603_1608]
R56  0R  [RES 0603_1608]
R57  0R  [RES 0603_1608]
R58  0R  [RES 0603_1608]
R59  0R  [RES 0603_1608]
R60  0R  [RES 0603_1608]
R61  0R  [RES 0603_1608]
R62  0R  [RES 0603_1608]
R63  0R  [RES 0603_1608]
R64  0R  [RES 0603_1608]
R65  0R  [RES 0603_1608]
R66  0R  [RES 0603_1608]
R67  0R  [RES 0603_1608]
R68  0R  [RES 0603_1608]
R69  680R  [RES 0603_1608]
U5  DC/DC_24_3V3  [SIP4DCDC]
X3  IPL1-108-02-L-D-K  [IPL1-108-02-L-D-K]

### Ports
/MSS_BUS[1..3] (bidir), DCLK_BUS[1..3] (bidir), DIG_IO (harness DigCon_DIG_IO), MCLK_BUS[1..3] (bidir), MI_BUS[1..3] (bidir), MO_BUS[1..3] (bidir), PowerSupply (harness DigCon_PowerSupply), VIA (bidir), VOB_BUS[1..3] (bidir)

### Harnesses
DigCon_DIG_IO: DIG_IO_01, DIG_IO_02, DIG_IO_03, DIG_IO_04, DIG_IO_05, DIG_IO_06, DIG_IO_07, DIG_IO_08, DIG_IO_09, DIG_IO_10, DIG_IO_11, DIG_IO_12, DIG_IO_13, DIG_IO_14, DIG_IO_15, DIG_IO_16, DIG_IO_17, DIG_IO_18, DIG_IO_19, DIG_IO_20, DIG_IO_21, DIG_IO_22, DIG_IO_23, DIG_IO_24, DIG_IO_25, DIG_IO_26, DIG_IO_27, DIG_IO_28, DIG_IO_29, DIG_IO_30
DigCon_PowerSupply: GND, 3V3, 5V, VIN

### Nets
+3V3: C36.2 R69.1 U5.6(Vout+)  [also labelled +3V3_DC/DC]
GND: C34.1 C35.1 C36.1 D2.1(K) U5.2(Vin-) U5.4(GND) X3.14 X3.15 X3.16 ; port PowerSupply.GND
VCC_Fused: C34.2 C35.2 F1.2 U5.1(Vin+)
VIN: F1.1 ; port PowerSupply.VIN  [also labelled VCC]
3V3_PER: X3.8 ; port PowerSupply.3V3
5V_PER: X3.7 ; port PowerSupply.5V
/MSS1: R53.2
/MSS2: R65.2
/MSS3: R59.2
DCLK1: R55.2
DCLK2: R67.2
DCLK3: R61.2
DIG_IO_01: R50.1 ; port DIG_IO.DIG_IO_01
DIG_IO_02: R51.1 ; port DIG_IO.DIG_IO_02
DIG_IO_03: R52.1 ; port DIG_IO.DIG_IO_03
DIG_IO_04: R53.1 ; port DIG_IO.DIG_IO_04
DIG_IO_05: R54.1 ; port DIG_IO.DIG_IO_05
DIG_IO_06: R55.1 ; port DIG_IO.DIG_IO_06
DIG_IO_07: R56.1 ; port DIG_IO.DIG_IO_07
DIG_IO_08: R57.1 ; port DIG_IO.DIG_IO_08
DIG_IO_09: R58.1 ; port DIG_IO.DIG_IO_09
DIG_IO_10: R59.1 ; port DIG_IO.DIG_IO_10
DIG_IO_11: R60.1 ; port DIG_IO.DIG_IO_11
DIG_IO_12: R61.1 ; port DIG_IO.DIG_IO_12
DIG_IO_13: R62.1 ; port DIG_IO.DIG_IO_13
DIG_IO_14: R63.1 ; port DIG_IO.DIG_IO_14
DIG_IO_15: R64.1 ; port DIG_IO.DIG_IO_15
DIG_IO_16: R65.1 ; port DIG_IO.DIG_IO_16
DIG_IO_17: R66.1 ; port DIG_IO.DIG_IO_17
DIG_IO_18: R67.1 ; port DIG_IO.DIG_IO_18
DIG_IO_19: R68.1 ; port DIG_IO.DIG_IO_19
DIG_IO_20: X3.1 ; port DIG_IO.DIG_IO_20
DIG_IO_21: X3.9 ; port DIG_IO.DIG_IO_21
DIG_IO_22: X3.2 ; port DIG_IO.DIG_IO_22
DIG_IO_23: X3.10 ; port DIG_IO.DIG_IO_23
DIG_IO_24: X3.3 ; port DIG_IO.DIG_IO_24
DIG_IO_25: X3.11 ; port DIG_IO.DIG_IO_25
DIG_IO_26: X3.4 ; port DIG_IO.DIG_IO_26
DIG_IO_27: X3.12 ; port DIG_IO.DIG_IO_27
DIG_IO_28: X3.5 ; port DIG_IO.DIG_IO_28
DIG_IO_29: X3.13 ; port DIG_IO.DIG_IO_29
DIG_IO_30: X3.6 ; port DIG_IO.DIG_IO_30
MCLK1: R50.2
MCLK2: R62.2
MCLK3: R56.2
MI1: R52.2
MI2: R64.2
MI3: R58.2
MO1: R51.2
MO2: R63.2
MO3: R57.2
VIA: R68.2 ; port VIA
VOB1: R54.2
VOB2: R66.2
VOB3: R60.2
NetD2_2: D2.2(A) R69.2

### Buses and harness runs
bus /MSS[1..3] = port /MSS_BUS[1..3]
bus DCLK[1..3] = port DCLK_BUS[1..3]
bus MCLK[1..3] = port MCLK_BUS[1..3]
bus MI[1..3] = port MI_BUS[1..3]
bus MO[1..3] = port MO_BUS[1..3]
bus VOB[1..3] = port VOB_BUS[1..3]

### Notes on the sheet
- Title
- Revision:
- Design Engineer:
- Date:
- Project:
- Sheet
- of

### Library data of the parts
C34 C36 = GRM185R60J106ME15D: as C2 on sheet LTC2983_Group_; Manufacturer Part Number: GRM185R60J106ME15D; PartID: 10; Created On: 20.12.2020 13:54:13; ComponentLink1Description: Datasheet; ComponentLink1URL: https://www.mouser.de/datasheet/2/281/murata_03052018_GRM_Series_1-1310166.pdf; Component Type: Capacitor 0603; Device Package: 0603; Last Updated: 27.05.2022 14:13:40; Mounting Type: SMD; Operating Temperature: -55 - 85°C; Series: GRM; Supplier 1: Mouser; Supplier Part Number 1: 81-GRM185R60J106ME5D; Type: Capacitor; Value: 10 µF; Live Cycle Status: 1; Stock number: Labor SMD Container; LCSC Part Number: C19702
C35 = C0603X104K5RAC7411: as C1 on sheet LTC2983_Group_; Manufacturer Part Number: C0603X104K5RAC7411; PartID: 3; Created On: 20.12.2020 13:54:13; ComponentLink1Description: Datasheet; ComponentLink1URL: https://www.mouser.de/datasheet/2/212/1/KEM_C1013_X7R_FT_CAP_SMD-1103280.pdf; Component Type: Capacitor 0603; Device Package: 0603; Last Updated: 04.03.2021 09:24:28; Mounting Type: SMD; Operating Temperature: -55 - 125°C; Series: SMD Comm X7R Flex; Supplier 1: Mouser; Supplier Part Number 1: 80-C0603X104K5R7411; Type: Capacitor; Value: 0.1 µF; Live Cycle Status: 1; Stock number: Labor SMD Container; Supplier 2: LCSC; Supplier Part Number 2: C14663; LCSC Part Number: C14663
D2 = 150060GS84000: as D1 on sheet LTC2983_Group_; Manufacturer Part Number: 150060GS84000; PartID: 2; Created On: 08.12.2020 10:41:11; ComponentLink1Description: Datasheet; ComponentLink1URL: https://www.mouser.de/datasheet/2/445/150060GS75020-1714345.pdf; Component Type: LED Diode; Device Package: 0603; Last Updated: 25.01.2024 19:29:32; Mounting Type: SMD; Operating Temperature: -40 - 85 °C; Supplier 1: Mouser; Supplier Part Number 1: 710-150060GS84000; Supplier 2: Farnell; Supplier Part Number 2: 3408612; Supplier 3: Digi-Key; Supplier Part Number 3: 732-150060GS84000CT-ND; Live Cycle Status: 1; Stock number: not stored; Color: green; LCSC Part Number: C72043
F1 = 0154.500DR: Fuse OMNI BLOK 154; Manufacturer: Littlefuse; Nominal current: 500 mA; Nominal voltage AC: 125 VAC; Nominal voltage DC: 125 VDC; Resistance: 304.6 mOhm; Value: 500 mA; Created from: MGremer; Manufacturer Part Number: 0154.500DR; PartID: 2; Created On: 07.01.2021 10:17:19; ComponentLink1Description: Datasheet; ComponentLink1URL: https://www.mouser.de/datasheet/2/240/Littelfuse_Fuse_154_154T_154L_154TL_Datasheet_pdf-365375.pdf; Component Type: NAN02 - 154 OMNI-BLOK; Device Package: OMNI-BLOK; Last Updated: 25.01.2024 19:51:27; Mounting Type: SMD; Operating Temperature: -55 - 125 °C; Series: 154; Supplier 1: Mouser; Supplier Part Number 1: 576-0154.500DR; Type: Fuse; Live Cycle Status: 1; LCSC Part Number: C720204
R50-R68 = RC0603JR-070RL: as R48 on sheet DigitalCarrierJack; Manufacturer Part Number: RC0603JR-070RL; PartID: 1; Created On: 14.12.2020 16:17:14; ComponentLink1Description: Datasheet; ComponentLink1URL: https://www.mouser.de/datasheet/2/447/PYu-RC_Group_51_RoHS_L_10-1664068.pdf; Component Type: SMD resistor; Device Package: 0603; Last Updated: 04.03.2021 09:09:42; Mounting Type: SMD; Supplier 1: Mouser; Supplier Part Number 1: 603-RC0603JR-070RL; Supplier 2: LCSC; Supplier Part Number 2: C21189; Type: Resistor; Value: 0R; Live Cycle Status: 1; Stock number: Labor SMD Container; LCSC Part Number: C21189
R69 = RK73B1JTTDD681J: as R2 on sheet LTC2983_Group_; Manufacturer Part Number: RK73B1JTTDD681J; PartID: 70; Created On: 14.12.2020 16:17:14; ComponentLink1Description: Datasheet; ComponentLink1URL: https://www.mouser.de/datasheet/2/219/RK73B-1825463.pdf; Component Type: SMD resistor; Device Package: 0603; Last Updated: 27.05.2022 08:00:04; Mounting Type: SMD; Supplier 1: Mouser; Supplier Part Number 1: 660-RK73B1JTTDD681J; Type: Resistor; Value: 680R; Live Cycle Status: 1; Stock number: Labor SMD Container; Supplier 2: LCSC; Supplier Part Number 2: C23228; LCSC Part Number: C23228
U5 = DC/DC_Single: pin to pad: 1>2 2>1 4>3 6>4; LCSC Part Number: C7500913
X3 = IPL1-108-02-L-D-K: 2.54 mm Double Row Termin Assembly (SMD); Manufacturer: SAMTEC; Created from: MGremer; Number of positions: 8; Manufacturer Part Number: IPL1-108-02-L-D-K; PartID: 18; Created On: 30.11.2020 10:38:50; ComponentLink1Description: Homepage; ComponentLink1URL: https://www.samtec.com/products/ipl1; Component Type: Samtec Connector; Device Package: Connector; Last Updated: 01.04.2021 08:16:12; Mounting Type: SMD; Supplier 1: SAMTEC; Supplier Part Number 1: IPL1-108-02-L-D-K; Type: Connector; Live Cycle Status: 1; Number of rows: 2; Stock number: not stored; Supplier 2: Digi-Key; Supplier Part Number 2: SAM9606-ND

## Nets that join several sheets
+3V3: LTC_Channel1 (C1A.2 IC1A.1), LTC_Channel2 (C1B.2 IC1B.1), LTC_Channel3 (C1C.2 IC1C.1), Harness_Wrapper (C36.2 R69.1 U5.6)
GND: DigitalCarrierJack (48 pins), LTC_Channel1 (6 pins), LTC_Channel2 (6 pins), LTC_Channel3 (6 pins), Harness_Wrapper (9 pins)
VCC_Fused: LTC_Channel1 (C3A.2 C6A.2 IC2A.1), LTC_Channel2 (C3B.2 C6B.2 IC2B.1), LTC_Channel3 (C3C.2 C6C.2 IC2C.1), Harness_Wrapper (C34.2 C35.2 F1.2 U5.1)
VIN: DigitalCarrierJack (X2.5 X2.6), Harness_Wrapper (F1.1)
3V3_PER: DigitalCarrierJack (10 pins), Harness_Wrapper (X3.8)
5V_PER: DigitalCarrierJack (X2.9 X2.10), Harness_Wrapper (X3.7)
/MSS1: LTC_Channel1 (IC1A.6), Harness_Wrapper (R53.2)
/MSS2: LTC_Channel2 (IC1B.6), Harness_Wrapper (R65.2)
/MSS3: LTC_Channel3 (IC1C.6), Harness_Wrapper (R59.2)
DCLK1: LTC_Channel1 (IC1A.9), Harness_Wrapper (R55.2)
DCLK2: LTC_Channel2 (IC1B.9), Harness_Wrapper (R67.2)
DCLK3: LTC_Channel3 (IC1C.9), Harness_Wrapper (R61.2)
DIG_IO_01: DigitalCarrierJack (X2.17), Harness_Wrapper (R50.1)
DIG_IO_02: DigitalCarrierJack (X2.18), Harness_Wrapper (R51.1)
DIG_IO_03: DigitalCarrierJack (X2.21), Harness_Wrapper (R52.1)
DIG_IO_04: DigitalCarrierJack (X2.22), Harness_Wrapper (R53.1)
DIG_IO_05: DigitalCarrierJack (X2.25), Harness_Wrapper (R54.1)
DIG_IO_06: DigitalCarrierJack (X2.26), Harness_Wrapper (R55.1)
DIG_IO_07: DigitalCarrierJack (X2.29), Harness_Wrapper (R56.1)
DIG_IO_08: DigitalCarrierJack (X2.30), Harness_Wrapper (R57.1)
DIG_IO_09: DigitalCarrierJack (X2.33), Harness_Wrapper (R58.1)
DIG_IO_10: DigitalCarrierJack (X2.34), Harness_Wrapper (R59.1)
DIG_IO_11: DigitalCarrierJack (X2.37), Harness_Wrapper (R60.1)
DIG_IO_12: DigitalCarrierJack (X2.38), Harness_Wrapper (R61.1)
DIG_IO_13: DigitalCarrierJack (X2.41), Harness_Wrapper (R62.1)
DIG_IO_14: DigitalCarrierJack (X2.42), Harness_Wrapper (R63.1)
DIG_IO_15: DigitalCarrierJack (X2.45), Harness_Wrapper (R64.1)
DIG_IO_16: DigitalCarrierJack (X2.46), Harness_Wrapper (R65.1)
DIG_IO_17: DigitalCarrierJack (X2.49), Harness_Wrapper (R66.1)
DIG_IO_18: DigitalCarrierJack (X2.50), Harness_Wrapper (R67.1)
DIG_IO_19: DigitalCarrierJack (X2.53), Harness_Wrapper (R68.1)
DIG_IO_20: DigitalCarrierJack (X2.54), Harness_Wrapper (X3.1)
DIG_IO_21: DigitalCarrierJack (X2.57), Harness_Wrapper (X3.9)
DIG_IO_22: DigitalCarrierJack (X2.58), Harness_Wrapper (X3.2)
DIG_IO_23: DigitalCarrierJack (X2.61), Harness_Wrapper (X3.10)
DIG_IO_24: DigitalCarrierJack (X2.62), Harness_Wrapper (X3.3)
DIG_IO_25: DigitalCarrierJack (X2.65), Harness_Wrapper (X3.11)
DIG_IO_26: DigitalCarrierJack (X2.66), Harness_Wrapper (X3.4)
DIG_IO_27: DigitalCarrierJack (X2.69), Harness_Wrapper (X3.12)
DIG_IO_28: DigitalCarrierJack (X2.70), Harness_Wrapper (X3.5)
DIG_IO_29: DigitalCarrierJack (X2.73), Harness_Wrapper (X3.13)
DIG_IO_30: DigitalCarrierJack (X2.74), Harness_Wrapper (X3.6)
MCLK1: LTC_Channel1 (IC1A.3), Harness_Wrapper (R50.2)
MCLK2: LTC_Channel2 (IC1B.3), Harness_Wrapper (R62.2)
MCLK3: LTC_Channel3 (IC1C.3), Harness_Wrapper (R56.2)
MI1: LTC_Channel1 (IC1A.5), Harness_Wrapper (R52.2)
MI2: LTC_Channel2 (IC1B.5), Harness_Wrapper (R64.2)
MI3: LTC_Channel3 (IC1C.5), Harness_Wrapper (R58.2)
MO1: LTC_Channel1 (IC1A.4), Harness_Wrapper (R51.2)
MO2: LTC_Channel2 (IC1B.4), Harness_Wrapper (R63.2)
MO3: LTC_Channel3 (IC1C.4), Harness_Wrapper (R57.2)
VIA: LTC_Channel1 (IC1A.7), LTC_Channel2 (IC1B.7), LTC_Channel3 (IC1C.7), Harness_Wrapper (R68.2)
VOB1: LTC_Channel1 (IC1A.8), Harness_Wrapper (R54.2)
VOB2: LTC_Channel2 (IC1B.8), Harness_Wrapper (R66.2)
VOB3: LTC_Channel3 (IC1C.8), Harness_Wrapper (R60.2)

## Assembly variants
All_Thermocouple: not fitted R24A R24B R24C R25A R25B R25C R26A R26B R26C R27A R27B R27C R28A R28B R28C R29A R29B R29C R30A R30B R30C R31A R31B R31C R32A R32B R32C R33A R33B R33C R34A R34B R34C R35A R35B R35C R36A R36B R36C R37A R37B R37C R38A R38B R38C R39A R39B R39C R40A R40B R40C R41A R41B R41C R42A R42B R42C R43A R43B R43C R44A R44B R44C R45A R45B R45C R46A R46B R46C R47A R47B R47C R55 R61 R67 X1B X3
All_2wire_RTD: not fitted R27A R27B R27C R29A R29B R29C R31A R31B R31C R33A R33B R33C R35A R35B R35C R37A R37B R37C R39A R39B R39C R41A R41B R41C R43A R43B R43C R44A R44B R44C R45A R45B R45C R46A R46B R46C R47A R47B R47C R55 R61 R67 X1B X3; alternate parts R24A -> 0603WAF1001T5E, R24B -> 0603WAF1001T5E, R24C -> 0603WAF1001T5E, R23A -> RC0603JR-070RL, R23B -> RC0603JR-070RL, R23C -> RC0603JR-070RL, R8A -> RC0603JR-070RL, R14A -> RC0603JR-070RL, R19A -> RC0603JR-070RL, R22A -> RC0603JR-070RL, R21A -> RC0603JR-070RL, R20A -> RC0603JR-070RL, R17A -> RC0603JR-070RL, R16A -> RC0603JR-070RL, R18A -> RC0603JR-070RL, R15A -> RC0603JR-070RL, R8B -> RC0603JR-070RL, R11B -> RC0603JR-070RL, R21B -> RC0603JR-070RL, R9B -> RC0603JR-070RL, R17B -> RC0603JR-070RL, R22B -> RC0603JR-070RL, R18B -> RC0603JR-070RL, R19B -> RC0603JR-070RL, R14B -> RC0603JR-070RL, R12B -> RC0603JR-070RL, R16B -> RC0603JR-070RL, R15B -> RC0603JR-070RL, R10B -> RC0603JR-070RL, R20B -> RC0603JR-070RL, R13B -> RC0603JR-070RL, R8C -> RC0603JR-070RL, R11C -> RC0603JR-070RL, R17C -> RC0603JR-070RL, R22C -> RC0603JR-070RL, R21C -> RC0603JR-070RL, R19C -> RC0603JR-070RL, R13C -> RC0603JR-070RL, R12C -> RC0603JR-070RL, R20C -> RC0603JR-070RL, R18C -> RC0603JR-070RL, R16C -> RC0603JR-070RL, R15C -> RC0603JR-070RL, R9C -> RC0603JR-070RL, R14C -> RC0603JR-070RL, R10C -> RC0603JR-070RL, R9A -> RC0603JR-070RL, R12A -> RC0603JR-070RL, R13A -> RC0603JR-070RL, R10A -> RC0603JR-070RL, R11A -> RC0603JR-070RL